# Altium project jp_2021.3.10.PrjPcb
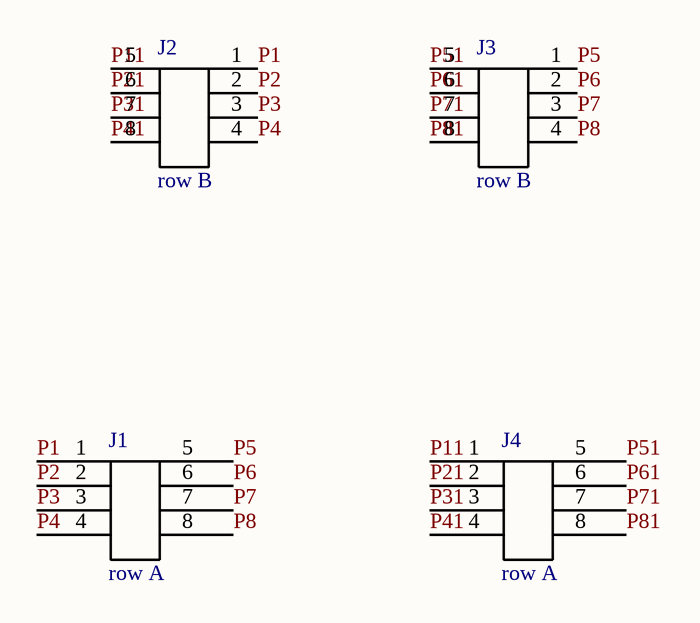
[diagram p0: jp_2021.3.10.SchDoc]
1 sheet, 4 parts. Net scope: global (net labels, ports and power ports of the same name join across sheets).
Board file: jp_2021.3.10.PcbDoc

## Sheet jp_2021.3.10.SchDoc
size A4

### Parts
J1  row A  [row A]
J2  row B  [row B]
J3  row B  [row B]
J4  row A  [row A]

### Nets
P1: J1.1 J2.1
P2: J1.2 J2.2
P3: J1.3 J2.3
P4: J1.4 J2.4
P5: J1.5 J3.1
P6: J1.6 J3.2
P7: J1.7 J3.3
P8: J1.8 J3.4
P11: J2.5 J4.1
P21: J2.6 J4.2
P31: J2.7 J4.3
P41: J2.8 J4.4
P51: J3.5 J4.5
P61: J3.6 J4.6
P71: J3.7 J4.7
P81: J3.8 J4.8